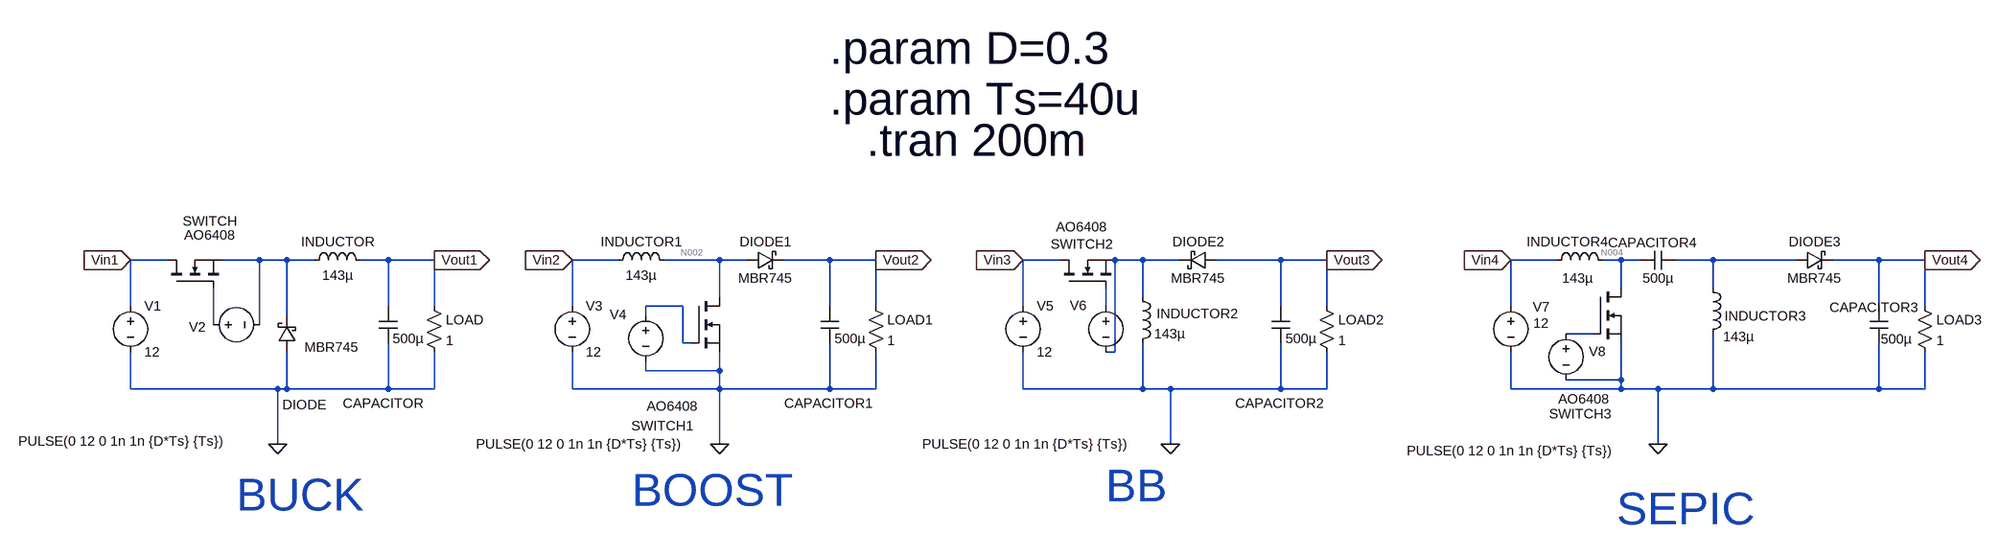
[diagram p0: schematic BUCK BOOST BB SEPIC CONVERTER.asc]
BUCK BOOST BB SEPIC CONVERTER.asc, the LTspice schematic file:
Version 4
SHEET 1 3504 680
WIRE 192 48 128 48
WIRE 352 48 288 48
WIRE 400 48 352 48
WIRE 448 48 400 48
WIRE 576 48 528 48
WIRE 656 48 576 48
WIRE 976 48 896 48
WIRE 1152 48 1056 48
WIRE 1200 48 1152 48
WIRE 1344 48 1264 48
WIRE 1424 48 1344 48
WIRE 1744 48 1680 48
WIRE 1888 48 1840 48
WIRE 1952 48 1888 48
WIRE 2128 48 2016 48
WIRE 2208 48 2128 48
WIRE 2608 48 2528 48
WIRE 2720 48 2688 48
WIRE 2752 48 2720 48
WIRE 2880 48 2816 48
WIRE 3024 48 2880 48
WIRE 3168 48 3088 48
WIRE 3248 48 3168 48
WIRE 2720 96 2720 48
WIRE 2880 96 2880 48
WIRE 1152 112 1152 48
WIRE 1888 112 1888 48
WIRE 128 128 128 48
WIRE 576 128 576 48
WIRE 656 128 656 48
WIRE 896 128 896 48
WIRE 1088 128 1024 128
WIRE 1344 128 1344 48
WIRE 1424 128 1424 48
WIRE 1680 128 1680 48
WIRE 1824 128 1824 96
WIRE 2128 128 2128 48
WIRE 2208 128 2208 48
WIRE 2528 128 2528 48
WIRE 3168 128 3168 48
WIRE 3248 128 3248 48
WIRE 400 144 400 48
WIRE 1024 144 1024 128
WIRE 272 160 272 96
WIRE 352 160 352 48
WIRE 2672 176 2624 176
WIRE 1088 192 1088 128
WIRE 1104 192 1088 192
WIRE 1840 208 1840 48
WIRE 1840 208 1824 208
WIRE 1024 240 1024 224
WIRE 1152 240 1152 208
WIRE 1152 240 1024 240
WIRE 2720 256 2720 192
WIRE 2720 256 2624 256
WIRE 128 272 128 208
WIRE 384 272 128 272
WIRE 400 272 400 208
WIRE 400 272 384 272
WIRE 576 272 576 192
WIRE 576 272 400 272
WIRE 656 272 656 208
WIRE 656 272 576 272
WIRE 896 272 896 208
WIRE 1152 272 1152 240
WIRE 1152 272 896 272
WIRE 1344 272 1344 192
WIRE 1344 272 1152 272
WIRE 1424 272 1424 208
WIRE 1424 272 1344 272
WIRE 1680 272 1680 208
WIRE 1888 272 1888 192
WIRE 1888 272 1680 272
WIRE 1936 272 1888 272
WIRE 2128 272 2128 192
WIRE 2128 272 1936 272
WIRE 2208 272 2208 208
WIRE 2208 272 2128 272
WIRE 2528 272 2528 208
WIRE 2720 272 2720 256
WIRE 2720 272 2528 272
WIRE 2784 272 2720 272
WIRE 2880 272 2880 176
WIRE 2880 272 2784 272
WIRE 3168 272 3168 192
WIRE 3168 272 2880 272
WIRE 3248 272 3248 208
WIRE 3248 272 3168 272
WIRE 384 368 384 272
WIRE 1152 368 1152 272
WIRE 1936 368 1936 272
WIRE 2784 368 2784 272
FLAG 384 368 0
FLAG 128 48 Vin1
IOPIN 128 48 In
FLAG 656 48 Vout1
IOPIN 656 48 Out
FLAG 1152 368 0
FLAG 896 48 Vin2
IOPIN 896 48 In
FLAG 1424 48 Vout2
IOPIN 1424 48 Out
FLAG 1936 368 0
FLAG 1680 48 Vin3
IOPIN 1680 48 In
FLAG 2208 48 Vout3
IOPIN 2208 48 Out
FLAG 2784 368 0
FLAG 2528 48 Vin4
IOPIN 2528 48 In
FLAG 3248 48 Vout4
IOPIN 3248 48 Out
SYMBOL voltage 128 112 R0
WINDOW 123 0 0 Left 0
WINDOW 39 0 0 Left 0
SYMATTR InstName V1
SYMATTR Value 12
SYMBOL nmos 192 96 R270
WINDOW 0 116 27 VRight 2
WINDOW 3 92 29 VRight 2
SYMATTR InstName SWITCH
SYMATTR Value AO6408
SYMBOL schottky 416 208 R180
WINDOW 0 -52 -91 Left 2
WINDOW 3 -108 9 Left 2
SYMATTR InstName DIODE
SYMATTR Value MBR745
SYMATTR Description Diode
SYMATTR Type diode
SYMBOL ind 432 64 R270
WINDOW 0 32 56 VTop 2
WINDOW 3 5 56 VBottom 2
SYMATTR InstName INDUCTOR
SYMATTR Value 143µ
SYMATTR SpiceLine Ipk=20m
SYMBOL cap 560 128 R0
WINDOW 0 -63 169 Left 2
SYMATTR InstName CAPACITOR
SYMATTR Value 500µ
SYMATTR SpiceLine V=1u
SYMBOL res 640 112 R0
SYMATTR InstName LOAD
SYMATTR Value 1
SYMBOL voltage 256 160 R270
WINDOW 0 -4 -26 VRight 2
WINDOW 3 -203 -323 VRight 2
WINDOW 123 0 0 Left 0
WINDOW 39 0 0 Left 0
SYMATTR InstName V2
SYMATTR Value PULSE(0 12 0 1n 1n {D*Ts} {Ts})
SYMBOL voltage 896 112 R0
WINDOW 123 0 0 Left 0
WINDOW 39 0 0 Left 0
SYMATTR InstName V3
SYMATTR Value 12
SYMBOL nmos 1104 112 R0
WINDOW 0 3 224 Right 2
WINDOW 3 10 190 Right 2
SYMATTR InstName SWITCH1
SYMATTR Value AO6408
SYMBOL schottky 1200 64 R270
WINDOW 0 32 32 VTop 2
WINDOW 3 0 32 VBottom 2
SYMATTR InstName DIODE1
SYMATTR Value MBR745
SYMATTR Description Diode
SYMATTR Type diode
SYMBOL ind 960 64 R270
WINDOW 0 32 56 VTop 2
WINDOW 3 5 56 VBottom 2
SYMATTR InstName INDUCTOR1
SYMATTR Value 143µ
SYMATTR SpiceLine Ipk=20m
SYMBOL cap 1328 128 R0
WINDOW 0 -63 169 Left 2
SYMATTR InstName CAPACITOR1
SYMATTR Value 500µ
SYMATTR SpiceLine V=1u
SYMBOL res 1408 112 R0
SYMATTR InstName LOAD1
SYMATTR Value 1
SYMBOL voltage 1024 128 R0
WINDOW 0 -63 15 Left 2
WINDOW 3 -295 240 Left 2
WINDOW 123 0 0 Left 0
WINDOW 39 0 0 Left 0
SYMATTR InstName V4
SYMATTR Value PULSE(0 12 0 1n 1n {D*Ts} {Ts})
SYMBOL voltage 1680 112 R0
WINDOW 123 0 0 Left 0
WINDOW 39 0 0 Left 0
SYMATTR InstName V5
SYMATTR Value 12
SYMBOL nmos 1744 96 R270
WINDOW 0 76 -16 VRight 2
WINDOW 3 106 -7 VRight 2
SYMATTR InstName SWITCH2
SYMATTR Value AO6408
SYMBOL schottky 2016 32 R90
WINDOW 0 0 32 VBottom 2
WINDOW 3 32 32 VTop 2
SYMATTR InstName DIODE2
SYMATTR Value MBR745
SYMATTR Description Diode
SYMATTR Type diode
SYMBOL ind 1872 96 R0
WINDOW 0 40 45 Left 2
SYMATTR InstName INDUCTOR2
SYMATTR Value 143µ
SYMATTR SpiceLine Ipk=20m
SYMBOL cap 2112 128 R0
WINDOW 0 -63 169 Left 2
SYMATTR InstName CAPACITOR2
SYMATTR Value 500µ
SYMATTR SpiceLine V=1u
SYMBOL res 2192 112 R0
SYMATTR InstName LOAD2
SYMATTR Value 1
SYMBOL voltage 1824 112 R0
WINDOW 0 -63 15 Left 2
WINDOW 3 -319 256 Left 2
WINDOW 123 0 0 Left 0
WINDOW 39 0 0 Left 0
SYMATTR InstName V6
SYMATTR Value PULSE(0 12 0 1n 1n {D*Ts} {Ts})
SYMBOL voltage 2528 112 R0
WINDOW 123 0 0 Left 0
WINDOW 39 0 0 Left 0
WINDOW 0 38 17 Left 2
WINDOW 3 39 46 Left 2
SYMATTR InstName V7
SYMATTR Value 12
SYMBOL nmos 2672 96 R0
WINDOW 0 31 219 Right 2
WINDOW 3 27 193 Right 2
SYMATTR InstName SWITCH3
SYMATTR Value AO6408
SYMBOL schottky 3024 64 R270
WINDOW 0 32 32 VTop 2
WINDOW 3 0 32 VBottom 2
SYMATTR InstName DIODE3
SYMATTR Value MBR745
SYMATTR Description Diode
SYMATTR Type diode
SYMBOL ind 2864 80 R0
WINDOW 0 36 65 Left 2
WINDOW 3 33 101 Left 2
SYMATTR InstName INDUCTOR3
SYMATTR Value 143µ
SYMATTR SpiceLine Ipk=20m
SYMBOL cap 3152 128 R0
WINDOW 0 -70 2 Left 2
WINDOW 3 19 57 Left 2
SYMATTR InstName CAPACITOR3
SYMATTR Value 500µ
SYMATTR SpiceLine V=1u
SYMBOL res 3232 112 R0
SYMATTR InstName LOAD3
SYMATTR Value 1
SYMBOL voltage 2624 160 R0
WINDOW 0 40 47 Left 2
WINDOW 3 -277 219 Left 2
WINDOW 123 0 0 Left 0
WINDOW 39 0 0 Left 0
SYMATTR InstName V8
SYMATTR Value PULSE(0 12 0 1n 1n {D*Ts} {Ts})
SYMBOL ind 2592 64 R270
WINDOW 0 32 34 VTop 2
WINDOW 3 0 52 VBottom 2
SYMATTR InstName INDUCTOR4
SYMATTR Value 143µ
SYMATTR SpiceLine Ipk=20m
SYMBOL cap 2816 32 R90
WINDOW 0 1 42 VBottom 2
WINDOW 3 32 32 VTop 2
SYMATTR InstName CAPACITOR4
SYMATTR Value 500µ
SYMATTR SpiceLine V=1u
TEXT 1344 -472 Left 6 !.param D=0.3
TEXT 1344 -384 Left 6 !.param Ts=40u
TEXT 1408 -312 Left 6 !.tran 200m
TEXT 312 456 Left 6 ;BUCK
TEXT 1000 448 Left 6 ;BOOST
TEXT 1824 440 Left 6 ;BB
TEXT 2712 480 Left 6 ;SEPIC

The netlist it stands for:
* BUCK BOOST BB SEPIC CONVERTER.asc
V1 Vin1 0 12
M§SWITCH Vin1 N008 N001 N001 AO6408
DIODE 0 N001 MBR745
L§INDUCTOR N001 Vout1 143µ Ipk=20m
CAPACITOR Vout1 0 500µ V=1u
R§LOAD Vout1 0 1
V2 N008 N001 PULSE(0 12 0 1n 1n {D*Ts} {Ts})
V3 Vin2 0 12
M§SWITCH1 N002 N006 0 0 AO6408
DIODE1 N002 Vout2 MBR745
L§INDUCTOR1 Vin2 N002 143µ Ipk=20m
CAPACITOR1 Vout2 0 500µ V=1u
R§LOAD1 Vout2 0 1
V4 N006 0 PULSE(0 12 0 1n 1n {D*Ts} {Ts})
V5 Vin3 0 12
M§SWITCH2 Vin3 N007 N003 N003 AO6408
DIODE2 Vout3 N003 MBR745
L§INDUCTOR2 N003 0 143µ Ipk=20m
CAPACITOR2 Vout3 0 500µ V=1u
R§LOAD2 Vout3 0 1
V6 N007 N003 PULSE(0 12 0 1n 1n {D*Ts} {Ts})
V7 Vin4 0 12
M§SWITCH3 N004 N009 0 0 AO6408
DIODE3 N005 Vout4 MBR745
L§INDUCTOR3 N005 0 143µ Ipk=20m
CAPACITOR3 Vout4 0 500µ V=1u
R§LOAD3 Vout4 0 1
V8 N009 0 PULSE(0 12 0 1n 1n {D*Ts} {Ts})
L§INDUCTOR4 Vin4 N004 143µ Ipk=20m
CAPACITOR4 N005 N004 500µ V=1u
.model D D
.lib standard.dio
.model NMOS NMOS
.model PMOS PMOS
.lib standard.mos
.param D=0.3
.param Ts=40u
.tran 200m
* BUCK
* BOOST
* BB
* SEPIC
.backanno
.end

* Results of the author's LTspice run, read from the files saved beside the schematic
* Operating Point, zero values left out:
*   V(vin1) = 12 V
*   V(vin2) = 12 V
*   V(n002) = 11.99 V
*   V(vout2) = 11.25 V
*   V(vin3) = 12 V
*   V(vin4) = 12 V
*   V(n004) = 12 V
*   Id(Switch3) = 975.4 pA
*   Is(Switch3) = -975.4 pA
*   Id(Switch2) = 975.1 pA
*   Is(Switch2) = -975.1 pA
*   Id(Switch1) = 975.4 pA
*   Is(Switch1) = -975.4 pA
*   Id(Switch) = 975.1 pA
*   Is(Switch) = -975.1 pA
*   I(Diode1) = 11.25 A
*   I(Diode) = -3.44 pA
*   I(Inductor4) = 989.4 pA
*   I(Inductor2) = 987.5 pA
*   I(Inductor1) = 11.25 A
*   I(Inductor) = 984 pA
*   I(Load1) = 11.25 A
*   I(Load) = 984 pA
*   I(V7) = -989.5 pA
*   I(V5) = -987.3 pA
*   I(V3) = -11.25 A
*   I(V1) = -987.3 pA